# Altium project K13-01.PrjPcb
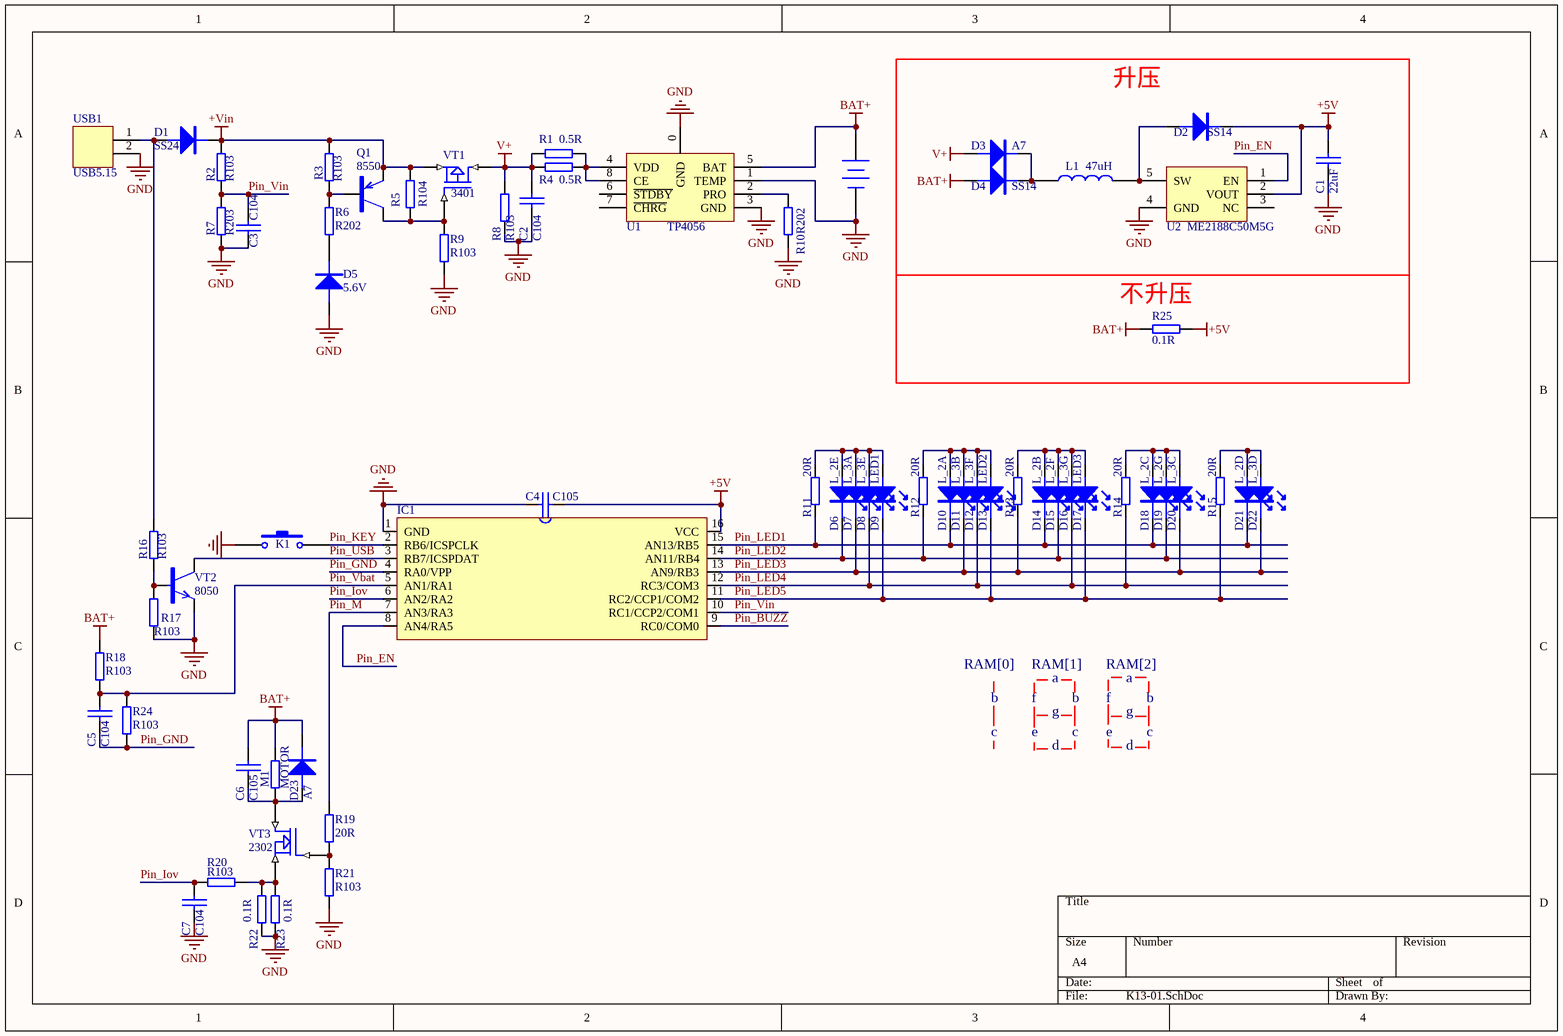
[diagram p0: K13-01.SchDoc]
1 sheet, 67 parts. Net scope: global (net labels, ports and power ports of the same name join across sheets).
Board file: K13-01.PcbDoc

## Sheet K13-01.SchDoc
size A4

### Parts
BT1  Battery  [BAT]  (value not drawn)
C1  22uF  [1206]
C2  C104  [0603]
C3  C104  [0603]
C4  C105  [0805N]
C5  C104  [0603]
C6  C105  [0805N]
C7  C104  [0603]
D1  SS24  [DO-214AC]
D2  SS14  [DO-214AC]
D3  A7  [DO-214AC]
D4  SS14  [DO-214AC]
D5  5.6V  [4148]
D6  L_2E  [LED0603]
D7  L_3A  [LED0603]
D8  L_3E  [LED0603]
D9  LED1  [LED0603]
D10  L_2A  [LED0603]
D11  L_3B  [LED0603]
D12  L_3F  [LED0603]
D13  LED2  [LED0603]
D14  L_2B  [LED0603]
D15  L_2F  [LED0603]
D16  L_3G  [LED0603]
D17  LED3  [LED0603]
D18  L_2C  [LED0603]
D19  L_2G  [LED0603]
D20  L_3C  [LED0603]
D21  L_2D  [LED0603]
D22  L_3D  [LED0603]
D23  A7  [4148]
IC1  (no value)  [SOP-16]
K1  SW-PB  [D6_SMT]  (value not drawn)
L1  47uH  [CD4X]
M1  MOTOR  [bat]
Q1  8550  [sot-23]
R1  0.5R  [1206]
R2  R103  [0603]
R3  R103  [0603]
R4  0.5R  [1206]
R5  R104  [0603]
R6  R202  [0603]
R7  R203  [0603]
R8  R103  [0603]
R9  R103  [0603]
R10  R202  [0603]
R11  20R  [0603]
R12  20R  [0603]
R13  20R  [0603]
R14  20R  [0603]
R15  20R  [0603]
R16  R103  [0603]
R17  R103  [0603]
R18  R103  [0603]
R19  20R  [0603]
R20  R103  [0603]
R21  R103  [0603]
R22  0.1R  [1206]
R23  0.1R  [1206]
R24  R103  [0603]
R25  0.1R  [1206]
U1  TP4056  [ESOP-8]
U2  ME2188C50M5G  [SOT-23-5]
USB1  USB5.15  [BAT]
VT1  3401  [SOT-23]
VT2  8050  [SOT-23]
VT3  2302  [sot-23]

### Nets
+5V: C1.1 C4.1 D2.2(K) IC1.16(VCC) R25.2 U2.2(VOUT)
+Vin: D1.2(K) Q1.2(E) R2.1 R3.1 R5.2 VT1.2(S)
BAT+: BT1.1(+) C6.2 D4.1(A) D23.2(K) M1.2 R18.2 R25.1 U1.5(BAT)
GND: BT1.2(-) C1.2 C2.1 C3.1 C4.2 C7.1 D5.1(A) IC1.1(GND) K1.1 R7.2 R8.2 R9.1 R10.2 R17.1 R21.2 R22.1 R23.1 U1.0(GND) U1.1(TEMP) U1.3(GND) U2.4(GND) USB1.2 VT2.2(E)
V+: C2.2 D3.1(A) R1.1 R4.1 R8.1 VT1.3(D)
Pin_BUZZ: IC1.9(RC0/COM0)
Pin_EN: IC1.8(AN4/RA5) U2.1(EN)
Pin_GND: C5.1 IC1.4(RA0/VPP) R24.2
Pin_Iov: C7.2 IC1.6(AN2/RA2) R20.1
Pin_KEY: IC1.2(RB6/ICSPCLK) K1.2
Pin_LED1: D10.2 D14.2 D18.2 D21.2 IC1.15(AN13/RB5) R11.1
Pin_LED2: D6.2 D15.2 D19.2 IC1.14(AN11/RB4) R12.1
Pin_LED3: D7.2 D11.2 D20.2 D22.2 IC1.13(AN9/RB3) R13.2
Pin_LED4: D8.2 D12.2 D16.2 IC1.12(RC3/COM3) R14.1
Pin_LED5: D9.2 D13.2 D17.2 IC1.11(RC2/CCP1/COM2) R15.1
Pin_M: IC1.7(AN3/RA3) R19.2
Pin_USB: IC1.3(RB7/ICSPDAT) VT2.3(C)
Pin_Vbat: C5.2 IC1.5(AN1/RA1) R18.1 R24.1
Pin_Vin: C3.2 IC1.10(RC1/CCP2/COM1) R2.2 R7.1
NetC6_1: C6.1 D23.1(A) M1.1 VT3.3(D)
NetD1_1: D1.1(A) R16.2 USB1.1
NetD2_1: D2.1(A) L1.2 U2.5(SW)
NetD3_2: D3.2(K) D4.2(K) L1.1
NetD5_2: D5.2(K) R6.1
NetD6_1: D6.1 D7.1 D8.1 D9.1 R11.2
NetD10_1: D10.1 D11.1 D12.1 D13.1 R12.2
NetD14_1: D14.1 D15.1 D16.1 D17.1 R13.1
NetD18_1: D18.1 D19.1 D20.1 R14.2
NetD21_1: D21.1 D22.1 R15.2
NetQ1_1: Q1.1(B) R3.2 R6.2
NetQ1_3: Q1.3(C) R5.1 R9.2 VT1.1(G)
NetR1_2: R1.2 R4.2 U1.4(VDD) U1.8(CE)
NetR10_1: R10.1 U1.2(PRO)
NetR16_1: R16.1 R17.2 VT2.1(B)
NetR19_1: R19.1 R21.1 VT3.1(G)
NetR20_2: R20.2 R22.2 R23.2 VT3.2(S)

Not connected (* = marked no-connect by the designer): U1 6(~{STDBY}) 7(~{CHRG}); U2 3(NC)

### Notes on the sheet
- 升压
- (near R25) 不升压
- RAM[0]
- b
- f
- RAM[1]
- a
- g
- RAM[2]
- c
- e
- d

### Library data of the parts
C1-C7 = CAP
D1-D5 D23 = DIODE
D6-D22 = LED
IC1 = MCU_1712
L1 = L: 1.5A以上
M1 R1-R25 = RES2
Q1 = 8550-SMT
U2 = TP5303
USB1 = USB2
VT1 = MOSFET P
VT2 = 8050-SMT
VT3 = MOSFET N
BT1 = Battery: Published: 24-Mar-1999; LatestRevisionDate: 17-Jul-2002; LatestRevisionNote: Re-released for DXP Platform.; PackageReference: BAT-2; Publisher: Altium Limited
K1 = SW-PB: Published: 24-Mar-1999; LatestRevisionDate: 17-Jul-2002; LatestRevisionNote: Re-released for DXP Platform.; PackageReference: SPST-2; Publisher: Altium Limited